# Altium schematic sheet 10_DDR2.SchDoc: RAM DDR2
size A3; Organization: Lime Microsystems; Address1: Surrey Tech Centre; Address2: Guildford GU2 7YG; Address3: Surray; Address4: United Kingdom; Revision: v1.2; SheetNumber: 10; SheetTotal: 14
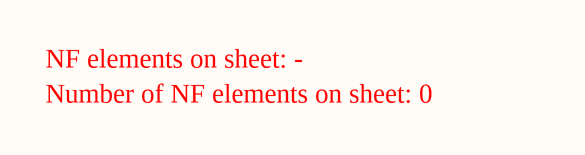
[diagram p0: 10_DDR2.SchDoc]

## Notes on the sheet
- Number of NF elements on sheet: 0
- NF elements on sheet: -
- Project name:
- Title:
- Size:
- Date:
- A3
- Revision:
- Time:
- Sheet
- of
- File: